# EAGLE design pic18f13k50 (EAGLE 6.5.0)
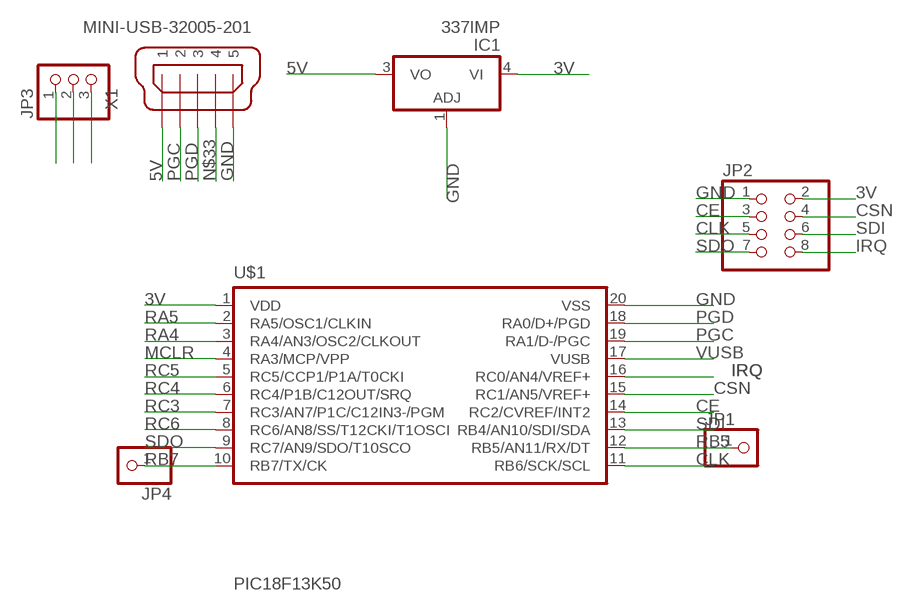
[diagram p0: schematic, sheet 1]

## Parts
IC1  337IMP  [SOT223]
JP1  PINHD-1X1  [1X01]
JP2  PINHD-2X4  [2X04]
JP3  PINHD-1X3  [1X03]
JP4  PINHD-1X1  [1X01]
U$1  PIC18F13K50  [SSOP20]
X1  MINI-USB-32005-201  [32005-201]

## Nets
3V: IC1.4(VI) JP2.2 JP3.2 U$1.1(VDD)
5V: IC1.3(VO) JP3.3 X1.1
CE: JP2.3 U$1.14(RC2/CVREF/INT2)
CLK: JP2.5 U$1.11(RB6/SCK/SCL)
CSN: JP2.4 U$1.15(RC1/AN5/VREF+)
GND: IC1.1(ADJ) JP2.1 U$1.20(VSS) X1.5
IRQ: JP2.8 U$1.16(RC0/AN4/VREF+)
MCLR: JP3.1 U$1.4(RA3/MCP/VPP)
N$33: X1.4
PGC: U$1.19(RA1/D-/PGC) X1.2
PGD: U$1.18(RA0/D+/PGD) X1.3
RA4: U$1.3(RA4/AN3/OSC2/CLKOUT)
RA5: U$1.2(RA5/OSC1/CLKIN)
RB5: JP1.1 U$1.12(RB5/AN11/RX/DT)
RB7: JP4.1 U$1.10(RB7/TX/CK)
RC3: U$1.7(RC3/AN7/P1C/C12IN3-/PGM)
RC4: U$1.6(RC4/P1B/C12OUT/SRQ)
RC5: U$1.5(RC5/CCP1/P1A/T0CKI)
RC6: U$1.8(RC6/AN8/SS/T12CKI/T1OSCI)
SDI: JP2.6 U$1.13(RB4/AN10/SDI/SDA)
SDO: JP2.7 U$1.9(RC7/AN9/SDO/T10SCO)
VUSB: U$1.17(VUSB)

## Library data of the parts
IC1 = linear:*337: Negative VOLTAGE REGULATOR
JP1 JP4 = pinhead:PINHD-1X1: PIN HEADER
JP2 = pinhead:PINHD-2X4: PIN HEADER
JP3 = pinhead:PINHD-1X3: PIN HEADER
U$1 = microchip-7:PIC18F13K50
X1 = con-cypressindustries 2:MINI-USB-: MINI USB-B Conector Source: www.cypressindustries.com

## Board
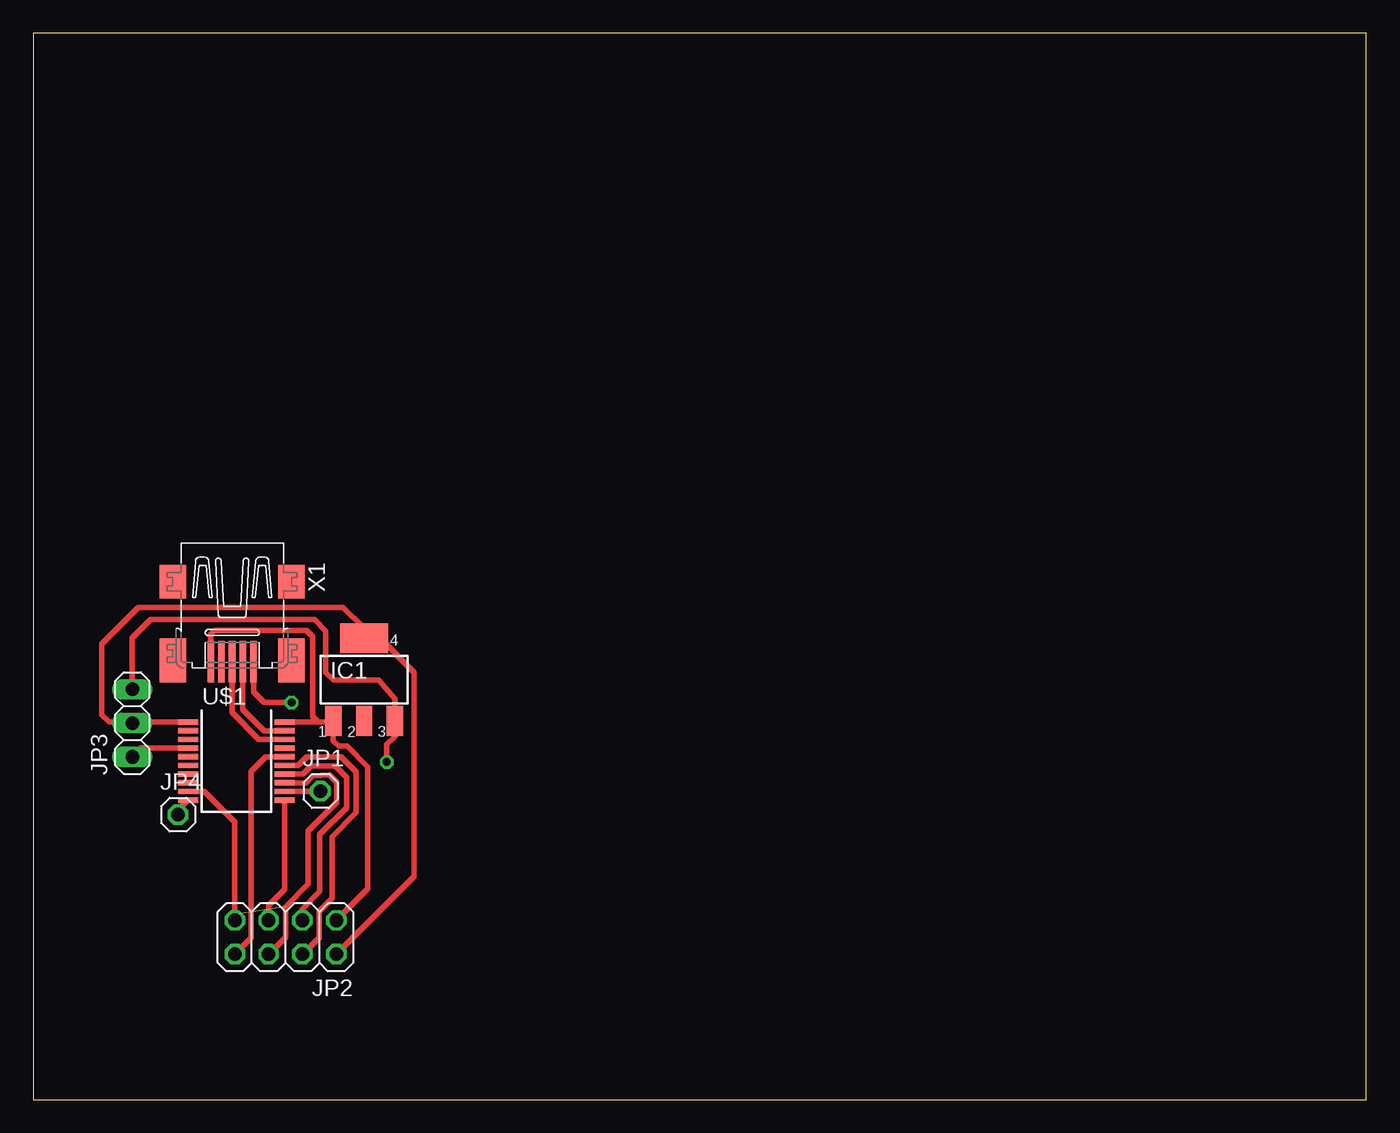
[diagram p1: board, top side]
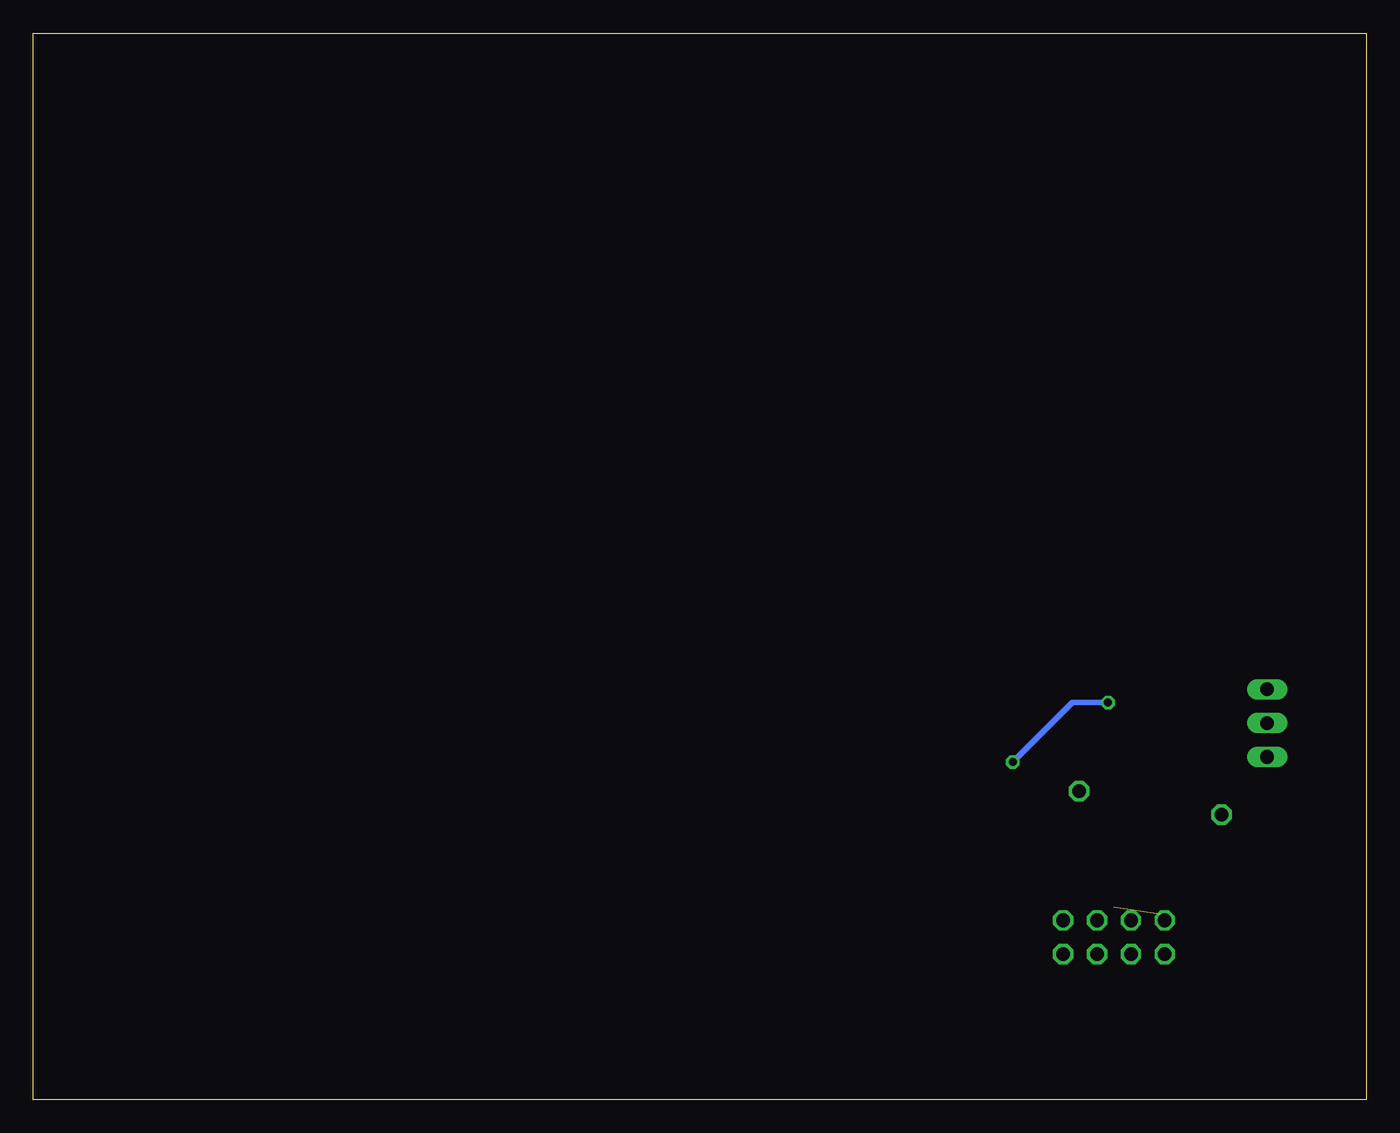
[diagram p2: board, bottom side, seen from below]

Size 100 x 80 mm. Coordinates in mm from the lower left corner, seen from the top.
Outline: 0,0 100,0 100,80 0,80 0,0
Copper layers (1*16): Top 0.035mm / dielectric 1.5mm / Bottom 0.035mm
Design rules "default": minimum track width 10mil, minimum drill 24mil, track to track 8mil, track to pad 8mil, pad to pad 8mil, via to via 8mil, smd to smd 8mil, copper to edge 40mil, drill to drill 8mil, minimum pad ring 10mil, minimum via ring 8mil, stop-mask expansion 4mil, vias tented up to drill 0mil, thermal gap 10mil

### Footprints (pad centres in the part's own frame; a part is rotated, then mirrored left to right if it is on the bottom)
SOT223 = smd 1.219 x 2.235: 1 -2.311,-3.099; 2 0,-3.099; 3 2.311,-3.099 | smd 3.6 x 2.2: 4 0,3.099
1X01 = drill 1.016 octagon: 1 0,0
2X04 = drill 1.016 octagon: 1 -3.81,-1.27; 2 -3.81,1.27; 3 -1.27,-1.27; 4 -1.27,1.27; 5 1.27,-1.27; 6 1.27,1.27; 7 3.81,-1.27; 8 3.81,1.27
1X03 = drill 1.016 long: 1 -2.54,0; 2 0,0; 3 2.54,0
SSOP20 = smd 0.4 x 1.5: 1 -2.925,-3.625; 2 -2.275,-3.625; 3 -1.625,-3.625; 4 -0.975,-3.625; 5 -0.325,-3.625; 6 0.325,-3.625; 7 0.975,-3.625; 8 1.625,-3.625; 9 2.275,-3.625; 10 2.925,-3.625; 11 2.925,3.625; 12 2.275,3.625; 13 1.625,3.625; 14 0.975,3.625; 15 0.325,3.625; 16 -0.325,3.625; 17 -0.975,3.625; 18 -1.625,3.625; 19 -2.275,3.625; 20 -2.925,3.625
32005-201 = smd 3.1 x 0.5: 1 3,1.6; 2 3,0.8; 3 3,0; 4 3,-0.8; 5 3,-1.6 | smd 2.5 x 2: M1 -3,-4.45; M2 -3,4.45 | smd 3.3 x 2: M3 2.9,4.45; M4 2.9,-4.45

### Placement (x,y rotation side)
IC1  24.82,31.5 0 top
JP1  21.55,23.15 0 top
JP2  18.92,12.17 180 top
JP3  7.42,28.24 90 top
JP4  10.86,21.37 0 top
U$1  15.24,25.4 270 top
X1  14.92,35.85 270 top

### Tracks (layer width: path | path; a pad name or v marks a point on that pad's centre or on a via)
3V
  Top 0.406: JP2.2 28.57,16.75 28.57,32.03 26.06,34.6 IC1.4 24.86,34.56 24.86,34.06 24.8,34.12 24.8,35.38 23.26,36.92 7.89,36.92 5.14,34.18 5.14,28.86 5.68,28.32 7.5,28.32 | U$1.1 7.5,28.32 | 7.5,28.32 JP3.2
5V  (via drill 0.6)
  Top 0.406: JP3.3 7.42,34.63 8.8,36.01 21.09,36.01 21.95,35.15 21.95,32.06 22.52,31.49 25.89,31.49 27.13,30.07 IC1.3 27.15,28.39 27.15,27.26 26.52,26.63 v26.52,25.32 | X1.1 16.52,30.57 17.32,29.77 v19.37,29.77
  Bottom 0.406: v19.37,29.77 22.06,29.77 v26.52,25.32
CE
  Top 0.406: U$1.14 20.25,24.43 20.86,25.03 22.63,25.03 23.49,24.17 23.49,21.89 21.49,19.89 21.49,15.6 20.17,14.29 20.17,13.46 JP2.3
CLK
  Top 0.406: U$1.11 18.86,15.78 17.66,14.57 JP2.5
CSN
  Top 0.406: U$1.15 19.87,25.07 20.52,25.72 23.09,25.72 24.23,24.57 24.23,21.55 22.4,19.72 22.4,15.09 21.43,14.12 21.43,12.14 JP2.4
GND
  Top 0.406: X1.5 13.32,34.92 13.6,35.2 20.52,35.2 20.97,34.75 20.97,28.73 21.37,28.32 | U$1.20 21.37,28.32 | 21.37,28.32 22.43,28.32 IC1.1 22.51,26.92 22.92,26.52 23.55,26.52 25.09,24.98 25.09,15.8 JP2.1
IRQ
  Top 0.406: U$1.16 17.44,25.73 16.34,24.63 16.34,12.13 JP2.8
MCLR
  Top 0.406: U$1.4 8.09,26.38 JP3.1
PGC
  Top 0.406: U$1.19 17.3,27.68 15.72,29.26 15.72,31.41 X1.2
PGD
  Top 0.406: U$1.18 16.92,27.02 14.92,29.03 14.92,31.41 X1.3
RB5
  Top 0.406: U$1.12 21.57,23.12 JP1.1
RB7
  Top 0.406: JP4.1 10.86,21.72 U$1.10
SDI  (1 unrouted)
  Top 0.406: 15.43,13.95 15.03,13.54 | U$1.13 20.46,23.77 20.97,24.29 22.23,24.35 22.75,23.83 22.75,22.29 20.63,20.17 20.63,16.17 18.92,14.46 18.92,12.17 JP2.6
SDO
  Top 0.406: U$1.9 12.82,23.12 15.11,20.83 JP2.7